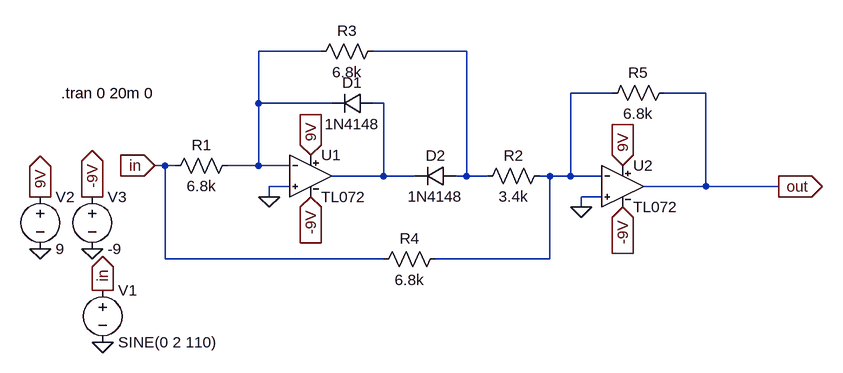
[diagram p0: schematic full-wave-rectifier.asc]
full-wave-rectifier.asc, the LTspice schematic file:
Version 4
SHEET 1 880 680
WIRE -128 96 -224 96
WIRE 96 96 -48 96
WIRE 320 160 256 160
WIRE 464 160 400 160
WIRE -224 176 -224 96
WIRE -112 176 -224 176
WIRE -32 176 -48 176
WIRE -368 272 -384 272
WIRE -352 272 -368 272
WIRE -224 272 -224 176
WIRE -224 272 -272 272
WIRE -176 272 -224 272
WIRE -32 288 -32 176
WIRE -32 288 -112 288
WIRE 16 288 -32 288
WIRE 96 288 96 96
WIRE 96 288 80 288
WIRE 128 288 96 288
WIRE 224 288 208 288
WIRE 256 288 256 160
WIRE 256 288 224 288
WIRE 304 288 256 288
WIRE -176 304 -208 304
WIRE 464 304 464 160
WIRE 464 304 368 304
WIRE 576 304 464 304
WIRE -208 320 -208 304
WIRE 304 320 272 320
WIRE 272 336 272 320
WIRE -368 416 -368 272
WIRE -32 416 -368 416
WIRE 224 416 224 288
WIRE 224 416 48 416
FLAG -464 544 0
FLAG -464 464 in
IOPIN -464 464 Out
FLAG -560 400 0
FLAG -480 400 0
FLAG -560 320 9V
IOPIN -560 320 Out
FLAG -480 320 -9V
IOPIN -480 320 Out
FLAG -144 256 9V
IOPIN -144 256 In
FLAG -144 320 -9V
IOPIN -144 320 In
FLAG -384 272 in
IOPIN -384 272 In
FLAG -208 320 0
FLAG 336 272 9V
IOPIN 336 272 In
FLAG 336 336 -9V
IOPIN 336 336 In
FLAG 272 336 0
FLAG 576 304 out
IOPIN 576 304 Out
SYMBOL Voltage -464 448 R0
SYMATTR InstName V1
SYMATTR Value SINE(0 2 110)
SYMATTR Value2 AC 0.2
SYMBOL TL072 -144 224 R0
SYMATTR InstName U1
SYMBOL Voltage -560 304 R0
SYMATTR InstName V2
SYMATTR Value 9
SYMBOL Voltage -480 304 R0
SYMATTR InstName V3
SYMATTR Value -9
SYMBOL Res -256 256 R90
WINDOW 0 0 56 VBottom 2
WINDOW 3 32 56 VTop 2
SYMATTR InstName R1
SYMATTR Value 6.8k
SYMBOL diode -48 160 R90
WINDOW 0 0 32 VBottom 2
WINDOW 3 32 32 VTop 2
SYMATTR InstName D1
SYMATTR Value 1N4148
SYMBOL Res 112 304 R270
WINDOW 0 32 56 VTop 2
WINDOW 3 0 56 VBottom 2
SYMATTR InstName R2
SYMATTR Value 3.4k
SYMBOL Res -32 80 R90
WINDOW 0 0 56 VBottom 2
WINDOW 3 32 56 VTop 2
SYMATTR InstName R3
SYMATTR Value 6.8k
SYMBOL diode 80 272 R90
WINDOW 0 0 32 VBottom 2
WINDOW 3 32 32 VTop 2
SYMATTR InstName D2
SYMATTR Value 1N4148
SYMBOL Res 64 400 R90
WINDOW 0 0 56 VBottom 2
WINDOW 3 32 56 VTop 2
SYMATTR InstName R4
SYMATTR Value 6.8k
SYMBOL TL072 336 240 R0
SYMATTR InstName U2
SYMBOL Res 416 144 R90
WINDOW 0 0 56 VBottom 2
WINDOW 3 32 56 VTop 2
SYMATTR InstName R5
SYMATTR Value 6.8k
TEXT -528 160 Left 2 !.tran 0 20m 0

The netlist it stands for:
* full-wave-rectifier.asc
V1 in 0 SINE(0 2 110) AC 0.2
XU1 0 N001 9V -9V N004 TL072  ; pins In+ In- V+ V- OUT
V2 9V 0 9
V3 -9V 0 -9
R1 N001 in 6.8k
D1 N004 N001 1N4148
R2 N002 N003 3.4k
R3 N002 N001 6.8k
D2 N002 N004 1N4148
R4 N003 in 6.8k
XU2 0 N003 9V -9V out TL072  ; pins In+ In- V+ V- OUT
R5 out N003 6.8k
.model D D
.lib standard.dio
.tran 0 20m 0
.lib TL072.sub
.backanno
.end